# Altium project scifab_camera_detector.PrjPcb
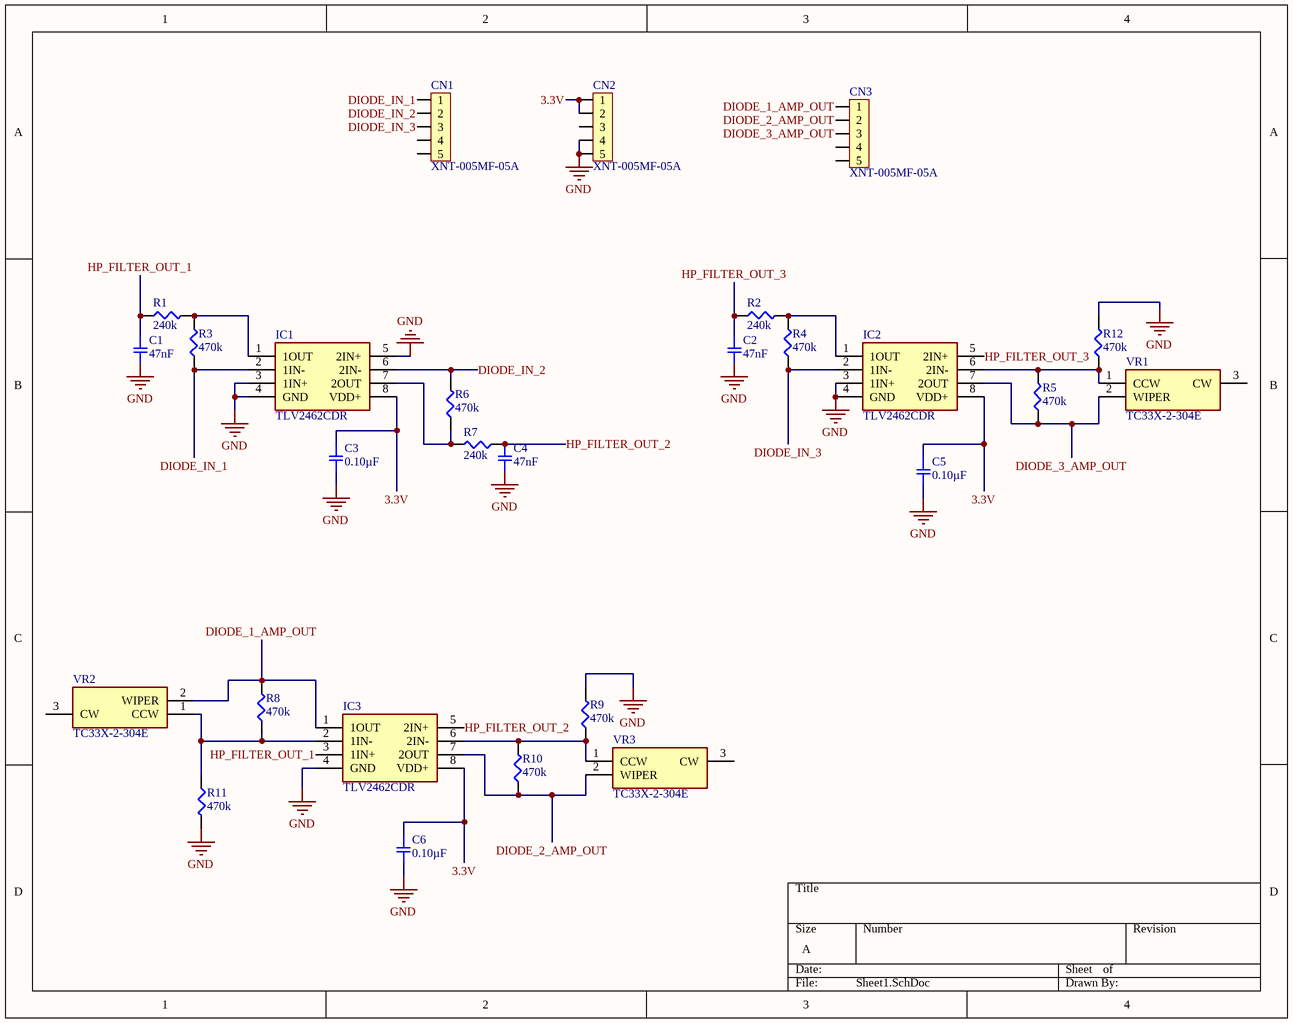
[diagram p0: Sheet1.SchDoc]
1 sheet, 27 parts. Net scope: global (net labels, ports and power ports of the same name join across sheets).
Board file: PCB1.PcbDoc

## Sheet Sheet1.SchDoc
size A

### Parts
C1  47nF  [SMD-0402C]
C2  47nF  [SMD-0402C]
C3  0.10µF  [SMD-0402C]
C4  47nF  [SMD-0402C]
C5  0.10µF  [SMD-0402C]
C6  0.10µF  [SMD-0402C]
CN1  XNT-005MF-05A  [XNT-005MF-05A]
CN2  XNT-005MF-05A  [XNT-005MF-05A]
CN3  XNT-005MF-05A  [XNT-005MF-05A]
IC1  TLV2462CDR  [SOIC127P600X175-8N]
IC2  TLV2462CDR  [SOIC127P600X175-8N]
IC3  TLV2462CDR  [SOIC127P600X175-8N]
R1  240k  [SMD-0402-RES]
R2  240k  [SMD-0402-RES]
R3  470k  [SMD-0402-RES]
R4  470k  [SMD-0402-RES]
R5  470k  [SMD-0402-RES]
R6  470k  [SMD-0402-RES]
R7  240k  [SMD-0402-RES]
R8  470k  [SMD-0402-RES]
R9  470k  [SMD-0402-RES]
R10  470k  [SMD-0402-RES]
R11  470k  [SMD-0402-RES]
R12  470k  [SMD-0402-RES]
VR1  TC33X-2-304E  [TC33X2304E]
VR2  TC33X-2-304E  [TC33X2304E]
VR3  TC33X-2-304E  [TC33X2304E]

### Nets
GND: C1.2 C2.2 C3.2 C4.2 C5.2 C6.2 CN2.4 CN2.5 IC1.3(1IN+) IC1.4(GND) IC1.5(2IN+) IC2.3(1IN+) IC2.4(GND) IC3.4(GND) R9.2 R11.2 R12.2
3.3V: C3.1 C5.1 C6.1 CN2.1 CN2.2 IC1.8(VDD+) IC2.8(VDD+) IC3.8(VDD+)
DIODE_1_AMP_OUT: CN3.1 IC3.1(1OUT) R8.2 VR2.2(WIPER)
DIODE_2_AMP_OUT: CN3.2 IC3.7(2OUT) R10.1 VR3.2(WIPER)
DIODE_3_AMP_OUT: CN3.3 IC2.7(2OUT) R5.1 VR1.2(WIPER)
DIODE_IN_1: CN1.1 IC1.2(1IN-) R3.1
DIODE_IN_2: CN1.2 IC1.6(2IN-) R6.2
DIODE_IN_3: CN1.3 IC2.2(1IN-) R4.1
HP_FILTER_OUT_1: C1.1 IC3.3(1IN+) R1.1
HP_FILTER_OUT_2: C4.1 IC3.5(2IN+) R7.1
HP_FILTER_OUT_3: C2.1 IC2.5(2IN+) R2.1
NetIC1_1: IC1.1(1OUT) R1.2 R3.2
NetIC1_7: IC1.7(2OUT) R6.1 R7.2
NetIC2_1: IC2.1(1OUT) R2.2 R4.2
NetIC2_6: IC2.6(2IN-) R5.2 R12.1 VR1.1(CCW)
NetIC3_2: IC3.2(1IN-) R8.1 R11.1 VR2.1(CCW)
NetIC3_6: IC3.6(2IN-) R9.1 R10.2 VR3.1(CCW)

Not connected (* = marked no-connect by the designer): CN1 4 5; CN2 3; CN3 4 5; VR1 3(CW); VR2 3(CW); VR3 3(CW)

### Library data of the parts
C1 C2 C4 = GJM1555C1H5R0BB01D: CAP CER 5PF 50V NP0 0402; Manufacturer: Murata Electronics North America; Factory Stock: 0; Unit Price (USD): 0.2; Minimum Quantity: 1; Tolerance: ±0.1pF; Temperature Coefficient: C0G, NP0; Datasheets: http://www.murata.com/~/media/webrenewal/support/library/catalog/products/capacitor/mlcc/c02e.pdf; Image: //media.digikey.com/Renders/Murata%20Renders/ZRB-SERIES-0402.jpg; Digi-Key Part Number: 490-8103-1-ND; Part Number: GJM1555C1H5R0BB01D; Quantity Available: 17055; @ qty: 0; Packaging: Cut Tape (CT); Series: GJM; Part Status: Active; Value: 47nF; Voltage: 50V; Operating Temperature: -55°C ~ 125°C; Features: High Q, Low Loss; Ratings: -; Applications: RF, Microwave, High Frequency; Mounting Type: Surface Mount, MLCC; Package / Case: 0402 (1005 Metric); Size / Dimension: 0.039" L x 0.020" W (1.00mm x 0.50mm); Height - Seated (Max): -; Thickness (Max): 0.022" (0.55mm); Lead Spacing: -; Lead Style: -
C3 C5 C6 = GCM155R71C104KA55D: CAP CER 0.1UF 16V X7R 0402; Manufacturer: Murata Electronics North America; Factory Stock: 0; Unit Price (USD): 0.1; Minimum Quantity: 1; Tolerance: ±10%; Datasheets: http://www.murata.com/~/media/webrenewal/support/library/catalog/products/capacitor/mlcc/c03e.ashx; Image: //media.digikey.com/Renders/Murata%20Renders/ZRB-SERIES-0402.jpg; Digi-Key Part Number: 490-4759-1-ND; Part Number: GCM155R71C104KA55D; Quantity Available: 734194; @ qty: 0; Packaging: Cut Tape (CT); Series: GCM; Part Status: Active; Value: 0.10µF; Voltage: 16V; Temperature Coefficient: X7R; Operating Temperature: -55°C ~ 125°C; Features: -; Ratings: AEC-Q200; Applications: Automotive; Mounting Type: Surface Mount, MLCC; Package / Case: 0402 (1005 Metric); Size / Dimension: 0.039" L x 0.020" W (1.00mm x 0.50mm); Height - Seated (Max): -; Thickness (Max): 0.022" (0.55mm); Lead Spacing: -; Lead Style: -
IC1-IC3 = TLV2462CDR: Integrated Circuit; Manufacturer_Name: Texas Instruments; Datasheet Link: http://www.ti.com/lit/gpn/tlv2462; Manufacturer_Part_Number: TLV2462CDR; Mouser Part Number: 595-TLV2462CDR; Mouser Price/Stock: https://www.mouser.com/Search/Refine.aspx?Keyword=595-TLV2462CDR; RS Part Number: 6610379; RS Price/Stock: https://uk.rs-online.com/web/p/products/6610379
R1-R12 = ERJ-2GEJ104X: RES SMD 470K OHM 5% 1/10W 0402; Manufacturer: Panasonic Electronic Components; Factory Stock: 0; Unit Price (USD): 0.00350; @ qty: 1500; Minimum Quantity: 1; Power (Watts): 0.1W, 1/10W; Temperature Coefficient: ±200ppm/°C; Part Number: ERJ-2GEJ104X; Datasheets: http://industrial.panasonic.com/www-cgi/jvcr13pz.cgi?E+PZ+3+AOA0001+ERJ2GEJ104X+7+WW; Image: //media.digikey.com/Photos/Panasonic%20Photos/ERJ-PA2-Series.jpg; Digi-Key Part Number: P100KJCT-ND; Quantity Available: 2387986; Packaging: Cut Tape (CT); Series: ERJ; Part Status: Active; Tolerance: ±5%; Composition: Thick Film; Features: Automotive AEC-Q200; Operating Temperature: -55°C ~ 155°C; Package / Case: 0402 (1005 Metric); Supplier Device Package: 0402; Size / Dimension: 0.039" L x 0.020" W (1.00mm x 0.50mm); Height - Seated (Max): 0.016" (0.40mm); Number of Terminations: 2; Failure Rate: -
  R1 R2 R7: Value: 240k
  R3-R6 R8-R12: Value: 470k
VR1-VR3 = TC33X-2-304E: Variable Resistor; Manufacturer_Name: Bourns; Datasheet Link: https://componentsearchengine.com/Datasheets/1/TC33X-2-304E.pdf; Height: 1.2mm; Manufacturer_Part_Number: TC33X-2-304E; Mouser Part Number: 652-TC33X-2-304E; Mouser Price/Stock: https://www.mouser.com/Search/Refine.aspx?Keyword=652-TC33X-2-304E